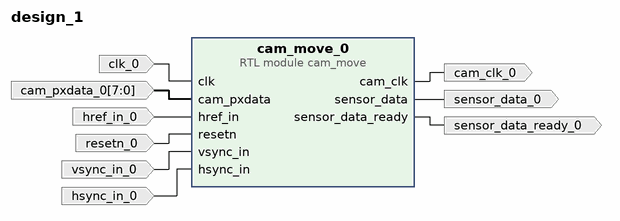
[diagram p0: block diagram of the top level]
# Vivado block design design_1, xc7a15tcsg325-3, Vivado 2017.3
create_bd_design design_1

create_bd_port -dir I -type clk clk_0
set_property -dict {CONFIG.FREQ_HZ 200000000 CONFIG.ASSOCIATED_RESET resetn_0} [get_bd_ports clk_0]
create_bd_port -dir I -from 7 -to 0 cam_pxdata_0
create_bd_port -dir I href_in_0
create_bd_port -dir I -type rst resetn_0
create_bd_port -dir I vsync_in_0
create_bd_port -dir I hsync_in_0
create_bd_port -dir O sensor_data_0
create_bd_port -dir O sensor_data_ready_0
create_bd_port -dir O -type clk cam_clk_0

create_bd_cell -type module -reference cam_move cam_move_0

# ---- connections ----

connect_bd_net -net clk_0_1 [get_bd_ports clk_0] [get_bd_pins cam_move_0/clk]
connect_bd_net -net cam_pxdata_0_1 [get_bd_ports cam_pxdata_0] [get_bd_pins cam_move_0/cam_pxdata]
connect_bd_net -net href_in_0_1 [get_bd_ports href_in_0] [get_bd_pins cam_move_0/href_in]
connect_bd_net -net resetn_0_1 [get_bd_ports resetn_0] [get_bd_pins cam_move_0/resetn]
connect_bd_net -net vsync_in_0_1 [get_bd_ports vsync_in_0] [get_bd_pins cam_move_0/vsync_in]
connect_bd_net -net hsync_in_0_1 [get_bd_ports hsync_in_0] [get_bd_pins cam_move_0/hsync_in]
connect_bd_net [get_bd_pins cam_move_0/sensor_data] [get_bd_ports sensor_data_0]
connect_bd_net [get_bd_pins cam_move_0/sensor_data_ready] [get_bd_ports sensor_data_ready_0]
connect_bd_net [get_bd_pins cam_move_0/cam_clk] [get_bd_ports cam_clk_0]

validate_bd_design
save_bd_design
